# EAGLE design 4313 Xbee V1.0 (EAGLE 6.4)
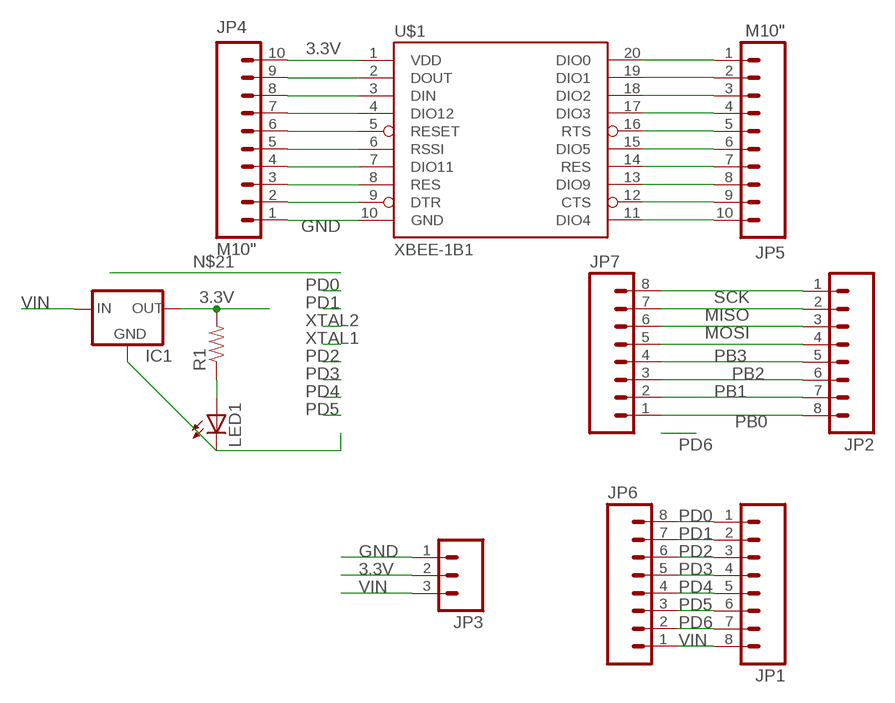
[diagram p0: schematic, sheet 1]

## Parts
IC1  V_REG_78XXSIDE  [78XXL]
JP1  M081X08  [1X08]
JP2  M081X08  [1X08]
JP3  M03PTH  [1X03]
JP4  M10"  [1X10]
JP5  M10"  [1X10]
JP6  M081X08  [1X08]
JP7  M081X08  [1X08]
LED1  LED1206  [LED-1206]
R1  RESISTOR1206  [1206]
U$1  XBEE-1B1  [XBEE-1]

## Nets
3.3V: IC1.OUT JP3.2 JP4.10 R1.2 U$1.1(VDD)
GND: IC1.GND JP3.1 JP4.1 LED1.C U$1.10(GND)
MISO: JP2.2 JP7.7
MOSI: JP2.3 JP7.6
N$1: LED1.A R1.1
N$3: JP4.2 U$1.9(DTR)
N$4: JP4.3 U$1.8(RES)
N$5: JP4.4 U$1.7(DIO11)
N$6: JP4.5 U$1.6(RSSI)
N$7: JP4.6 U$1.5(RESET)
N$8: JP4.7 U$1.4(DIO12)
N$9: JP4.8 U$1.3(DIN)
N$10: JP4.9 U$1.2(DOUT)
N$12: JP5.1 U$1.20(DIO0)
N$13: JP5.2 U$1.19(DIO1)
N$14: JP5.3 U$1.18(DIO2)
N$15: JP5.4 U$1.17(DIO3)
N$16: JP5.5 U$1.16(RTS)
N$17: JP5.6 U$1.15(DIO5)
N$18: JP5.7 U$1.14(RES)
N$19: JP5.8 U$1.13(DIO9)
N$20: JP5.9 U$1.12(CTS)
N$22: JP5.10 U$1.11(DIO4)
PB0: JP2.8 JP7.1
PB1: JP2.7 JP7.2
PB2: JP2.6 JP7.3
PB3: JP2.5 JP7.4
PB4: JP2.4 JP7.5
PD0: JP1.1 JP6.8
PD1: JP1.2 JP6.7
PD2: JP1.3 JP6.6
PD3: JP1.4 JP6.5
PD4: JP1.5 JP6.4
PD5: JP1.6 JP6.3
PD6: JP1.7 JP6.2
SCK: JP2.1 JP7.8
VIN: IC1.IN JP1.8 JP3.3 JP6.1

## Library data of the parts
IC1 = SparkFun-PowerIC:V_REG_78XX: Voltage Regulator Standard 7805 5V regulator. IGO (Input Ground Output). Spark Fun Electronics SKU : COM-00107
JP1 JP2 JP6 JP7 = SparkFun-Connectors:M08: Header 8 Standard 8-pin 0.1" header. Use with straight break away headers (SKU : PRT-00116), right angle break away headers (PRT-00553), swiss pins (PRT-00743), machine pins (PRT-00117), and female headers (PRT-00115).
JP3 = SparkFun-Connectors:M03: Header 3 Standard 3-pin 0.1" header. Use with straight break away headers (SKU : PRT-00116), right angle break away headers (PRT-00553), swiss pins (PRT-00743), machine pins (PRT-00117), and female headers (PRT-00115). Molex polarized connector foot print use with SKU : PRT-08232 with associated crimp pins and housings.
JP4 JP5 = SparkFun-Connectors:M10: Header 10 Standard 10-pin 0.1" header. Use with straight break away headers (SKU : PRT-00116), right angle break away headers (PRT-00553), swiss pins (PRT-00743), machine pins (PRT-00117), and female headers (PRT-00115).
LED1 = SparkFun-LED:LED: LEDs Standard schematic elements and footprints for 5mm, 3mm, 1206, and 0603 sized LEDs. 5mm - Spark Fun Electronics SKU : COM-00529 (and others)
R1 = SparkFun-Resistors:RESISTOR: Resistor Basic schematic elements and footprints for 0603, 1206, and PTH resistors.
U$1 = SparkFun-RF:XBEE-1: Xbee module footprints SMT header is CONN-09042.

## Board
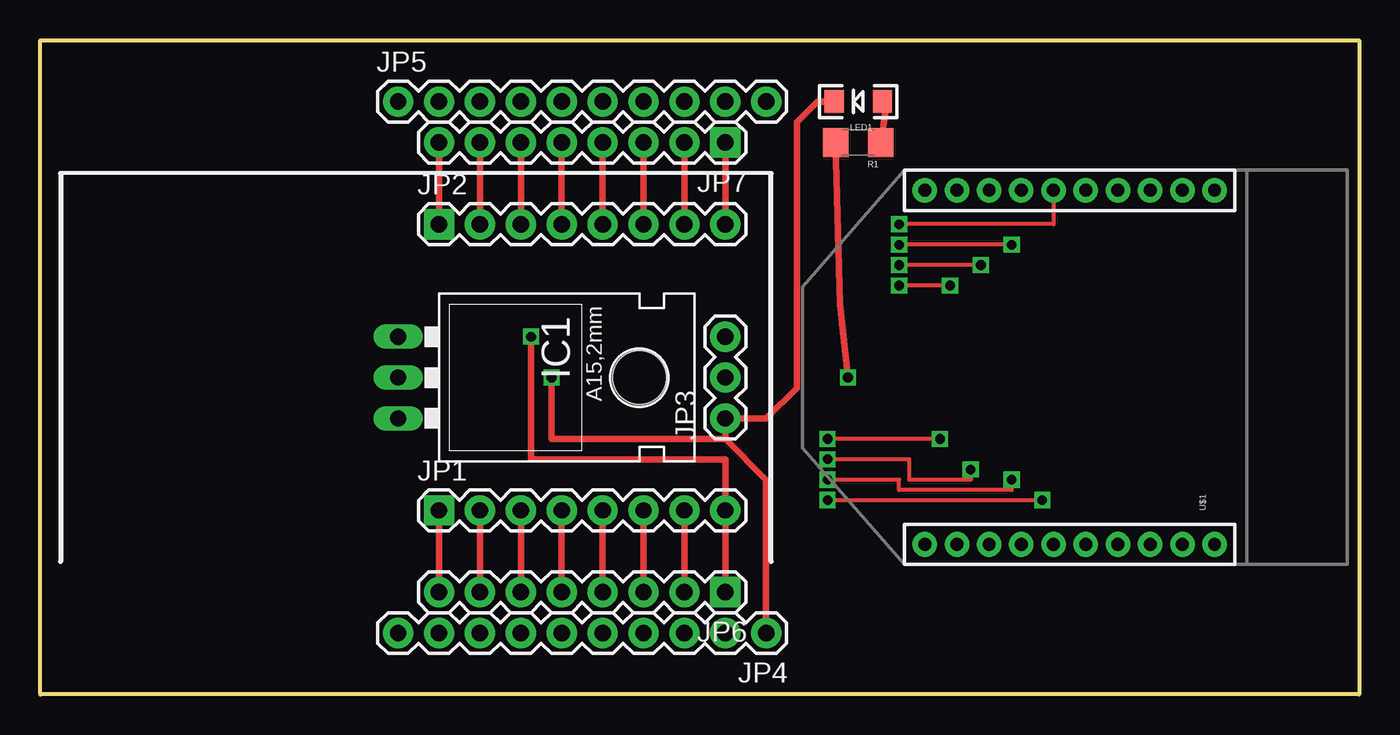
[diagram p1: board, top side]
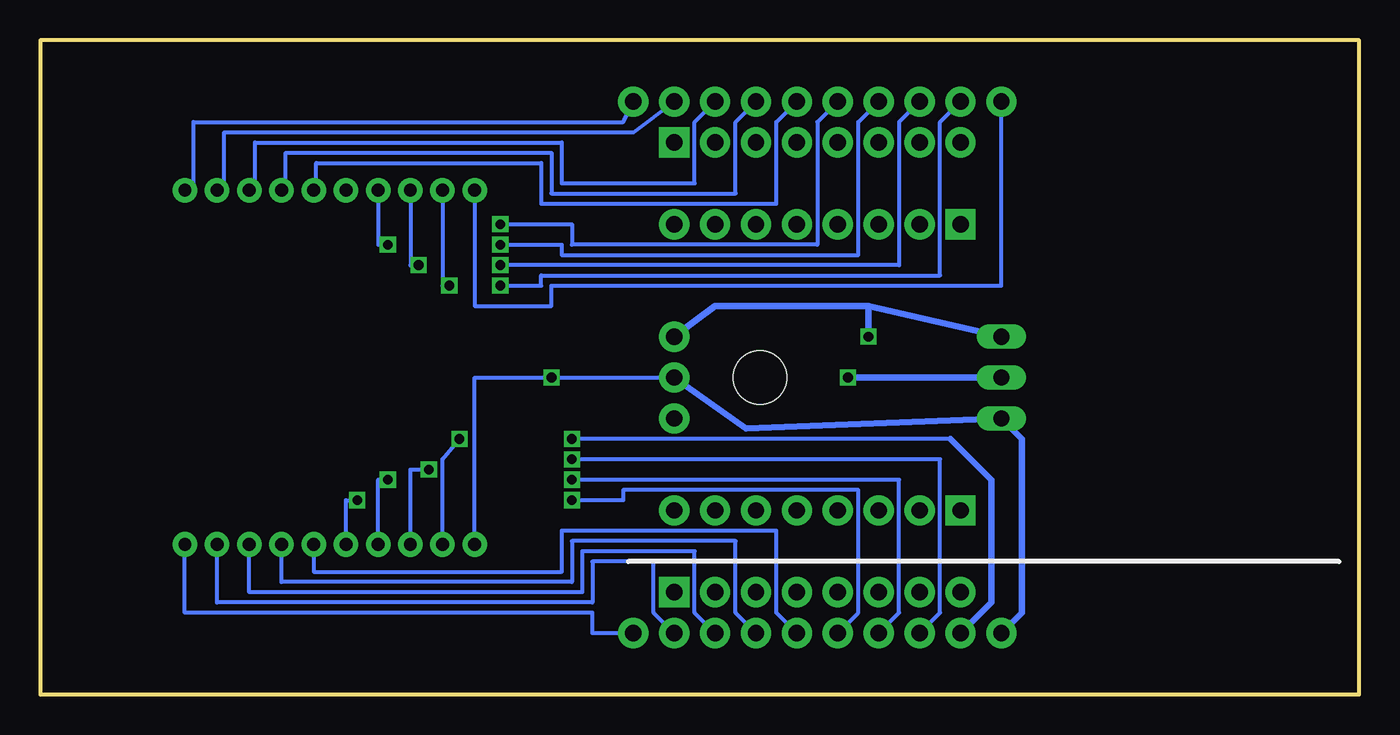
[diagram p2: board, bottom side, seen from below]

Size 81.91 x 40.64 mm. Coordinates in mm from the lower left corner, seen from the top.
Outline: 0,0 0,40.64 81.91,40.64 81.91,0 0,0
Copper layers (1*16): Top 0.035mm / dielectric 1.5mm / Bottom 0.035mm
Design rules "default": minimum track width 10mil, minimum drill 24mil, track to track 8mil, track to pad 8mil, pad to pad 8mil, via to via 8mil, smd to smd 8mil, copper to edge 40mil, drill to drill 8mil, minimum pad ring 10mil, minimum via ring 8mil, stop-mask expansion 4mil, vias tented up to drill 0mil, thermal gap 10mil

### Footprints (pad centres in the part's own frame; a part is rotated, then mirrored left to right if it is on the bottom)
78XXL = drill 1.016 long: GND 0,-3.81; IN -2.54,-3.81; OUT 2.54,-3.81 | hole 3.302: 0,11.176
1X08 = drill 1.016 pad 1.88 square: 1 0,0 | drill 1.016 pad 1.88: 2 2.54,0; 3 5.08,0; 4 7.62,0; 5 10.16,0; 6 12.7,0; 7 15.24,0; 8 17.78,0
1X03 = drill 1.016 pad 1.88: 1 0,0; 2 2.54,0; 3 5.08,0
1X10 = drill 1.016 pad 1.88: 1 0,0; 2 2.54,0; 3 5.08,0; 4 7.62,0; 5 10.16,0; 6 12.7,0; 7 15.24,0; 8 17.78,0; 9 20.32,0; 10 22.86,0
LED-1206 = smd 1.2 x 1.4: A -1.5,0; C 1.5,0
1206 = smd 1.6 x 1.8: 1 -1.4,0; 2 1.4,0
XBEE-1 = drill 0.8 pad 1.524: 1 -11,20; 2 -11,18; 3 -11,16; 4 -11,14; 5 -11,12; 6 -11,10; 7 -11,8; 8 -11,6; 9 -11,4; 10 -11,2; 11 11,2; 12 11,4; 13 11,6; 14 11,8; 15 11,10; 16 11,12; 17 11,14; 18 11,16; 19 11,18; 20 11,20

### Placement (x,y rotation side)
IC1  26.04,19.69 270 top
JP1  24.76,11.43 0 top
JP2  24.76,29.21 0 top
JP3  42.55,17.14 90 top
JP4  45.09,3.81 180 top
JP5  22.22,36.83 0 top
JP6  42.55,6.35 180 top
JP7  42.55,34.29 180 top
LED1  50.8,36.83 180 top
R1  50.8,34.29 180 top
U$1  74.93,20.32 90 top

### Tracks (layer width: path | path; a pad name or v marks a point on that pad's centre or on a via)
3.3V  (via drill 0.6)
  Top 0.406: R1.2 49.66,24.26 v50.16,19.69
  Bottom 0.254: U$1.1 54.93,19.69 v50.16,19.69 JP3.2
  Bottom 0.406: JP4.10 20.95,5.08 20.95,15.88 IC1.OUT 38.1,16.51 JP3.2
GND  (via drill 0.6)
  Top 0.406: 42.55,15.88 JP3.1 45.09,17.14 46.99,19.05 46.99,35.56 48.26,36.83 LED1.C | 42.55,15.88 45.09,13.34 JP4.1 | v31.75,19.69 31.75,15.88 42.55,15.88
  Bottom 0.254: JP4.1 47.62,3.81 47.62,5.08 72.93,5.08 U$1.10
  Bottom 0.406: IC1.GND v31.75,19.69
MISO
  Top 0.406: JP2.2 JP7.7
MOSI
  Top 0.406: JP7.6 JP2.3
N$1
  Top 0.406: R1.1 52.48,36.2 LED1.A
N$3
  Bottom 0.254: JP4.2 43.82,5.08 43.82,8.25 47.62,8.25 47.62,5.72 70.93,5.72 U$1.9
N$4
  Bottom 0.254: JP4.3 41.27,5.08 41.27,8.89 48.26,8.89 48.26,6.35 68.93,6.35 U$1.8
N$5
  Bottom 0.254: JP4.4 38.73,5.08 38.73,9.52 48.9,9.52 48.9,6.99 66.93,6.99 U$1.7
N$6
  Bottom 0.254: JP4.5 36.2,5.08 36.2,10.16 49.53,10.16 49.53,7.62 64.93,7.62 U$1.6
N$7  (via drill 0.6)
  Top 0.254: v62.23,12.07 v48.9,12.07
  Bottom 0.254: JP4.6 31.11,5.08 31.11,12.7 45.72,12.7 45.72,12.07 v48.9,12.07 | U$1.5 62.93,12.07 v62.23,12.07
N$8  (via drill 0.6)
  Top 0.254: v60.33,13.34 60.33,12.7 53.34,12.7 53.34,13.34 v48.9,13.34
  Bottom 0.254: JP4.7 28.57,5.08 28.57,13.34 v48.9,13.34 | U$1.4 60.93,13.34 v60.33,13.34
N$9  (via drill 0.6)
  Top 0.254: v57.79,13.97 57.79,13.34 53.98,13.34 53.98,14.61 v48.9,14.61
  Bottom 0.254: JP4.8 26.04,5.08 26.04,14.61 v48.9,14.61 | U$1.3 58.93,13.97 v57.79,13.97
N$10  (via drill 0.6)
  Top 0.254: v55.88,15.88 v48.9,15.88
  Bottom 0.254: 25.4,15.88 v48.9,15.88 | U$1.2 56.93,14.61 v55.88,15.88
  Bottom 0.406: JP4.9 22.86,5.72 22.86,13.34 25.4,15.88
N$12
  Bottom 0.254: U$1.20 54.93,24.13 50.16,24.13 50.16,25.4 22.22,25.4 JP5.1
N$13  (via drill 0.6)
  Top 0.254: v56.52,25.4 v53.34,25.4
  Bottom 0.254: U$1.19 56.93,25.4 v56.52,25.4 | v53.34,25.4 50.8,25.4 50.8,26.04 26.04,26.04 26.04,35.56 JP5.2
N$14  (via drill 0.6)
  Top 0.254: v58.42,26.67 v53.34,26.67
  Bottom 0.254: U$1.18 58.93,26.67 v58.42,26.67 | JP5.3 28.57,35.56 28.57,26.67 v53.34,26.67
N$15  (via drill 0.6)
  Top 0.254: v60.33,27.94 v53.34,27.94
  Bottom 0.254: U$1.17 60.93,27.94 v60.33,27.94 | v53.34,27.94 49.53,27.94 49.53,27.3 31.11,27.3 31.11,35.56 JP5.4
N$16  (via drill 0.6)
  Top 0.254: U$1.16 62.93,29.21 v53.34,29.21
  Bottom 0.254: v53.34,29.21 48.9,29.21 48.9,27.94 33.66,27.94 33.66,35.56 JP5.5
N$17
  Bottom 0.254: U$1.15 64.77,31.32 64.77,33.02 50.8,33.02 50.8,30.48 36.2,30.48 36.2,35.56 JP5.6
N$18
  Bottom 0.254: U$1.14 66.67,31.32 66.67,33.66 50.16,33.66 50.16,31.12 38.73,31.12 38.73,35.56 JP5.7
N$19
  Bottom 0.254: U$1.13 68.58,31.32 68.58,34.29 49.53,34.29 49.53,31.75 41.27,31.75 41.27,35.56 JP5.8
N$20
  Bottom 0.254: U$1.12 70.48,31.32 70.48,34.93 45.09,34.93 JP5.9
N$22
  Bottom 0.254: U$1.11 73.02,31.32 73.02,31.12 72.39,31.12 72.39,35.56 45.72,35.56 JP5.10
PB0
  Top 0.406: JP2.8 JP7.1
PB1
  Top 0.406: JP2.7 JP7.2
PB2
  Top 0.406: JP2.6 JP7.3
PB3
  Top 0.406: JP2.5 JP7.4
PB4
  Top 0.406: JP2.4 JP7.5
PD0
  Top 0.406: JP1.1 JP6.8
PD1
  Top 0.406: JP6.7 JP1.2
PD2
  Top 0.406: JP6.6 JP1.3
PD3
  Top 0.406: JP6.5 JP1.4
PD4
  Top 0.406: JP6.4 JP1.5
PD5
  Top 0.406: JP1.6 JP6.3
PD6
  Top 0.406: JP6.2 JP1.7
SCK
  Top 0.406: JP7.8 JP2.1
VIN  (via drill 0.6)
  Top 0.406: JP6.1 JP1.8 42.55,14.61 30.48,14.61 v30.48,22.23
  Bottom 0.406: v30.48,22.23 30.48,24.13 | 30.48,24.13 40.01,24.13 JP3.3 | IC1.IN 30.48,24.13